# EasyEDA Pro project ProDoc_HMI_2026-03-18.epro

# Board Edge2
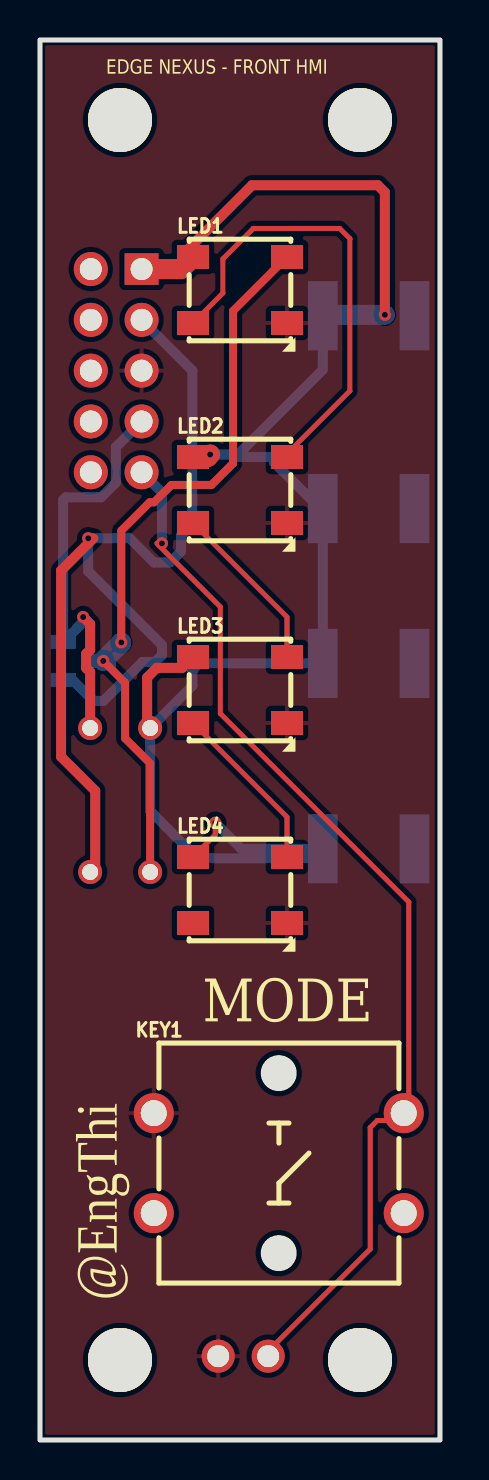
[diagram p0: board, top side]
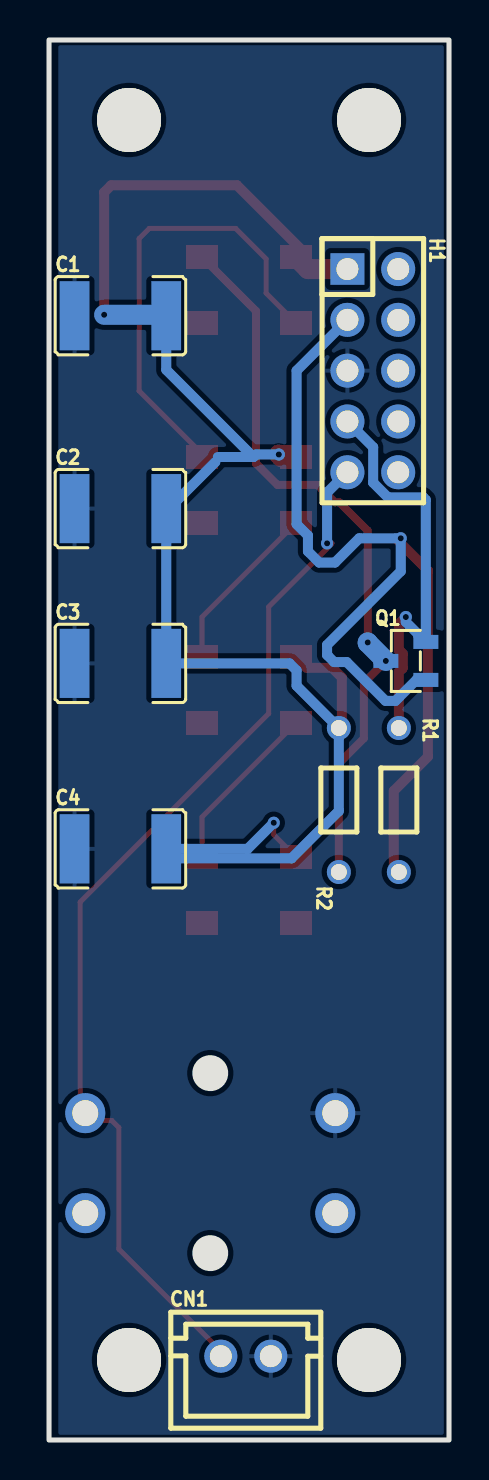
[diagram p1: board, bottom side, seen from below]

Outline 20 x 70 mm; copper layers: Top Layer, Bottom Layer. Coordinates in mm from the lower left corner of the outline.
Outline path: rectangle 0,0 20,70
Stack: Top Layer 0.035mm / Dielectric1 1.51mm FR4 er 4.5 / Bottom Layer 0.035mm

## Design rules (mm)
template: Custom Config
spacing copperThickness1oz (default): track to track 0.102, other pairs 0.152 to 0.3
spacing copperThickness2oz: track to track 0.203, other pairs 0.152 to 0.3
track width copperThickness1oz (default): min 0.127, default 0.254, max 2.54
track width copperThickness2oz: min 0.203, default 0.254, max 2.54
differential pair differentialPair (default): width min 0.127, default 0.254, max 2.54; gap min 0.152, default 0.152
via viaSize (default): diameter min 0.5, default 0.61, max 10; hole min 0.3, default 0.305, max 6.3

## Placement (name value [footprint] x y rotation side)
C1  100nF  [C1812]  16.43 56.21 180 bottom
C2  100nF  [C1812]  16.43 46.57 180 bottom
C3  100nF  [C1812]  16.43 38.83 180 bottom
C4  100nF  [C1812]  16.43 29.56 180 bottom
CN1  2.54mm-2P ZZ  [CONN-TH_2.54MM-2P-ZZ]  10.16 4.19 180 bottom
H1  排母2.54mm2*5p 直  [HDR-TH_10P-P2.54-V-F-R2-C5-S2.54]  3.81 53.47 270 bottom
KEY1  B3F-4055  [KEY-TH_4P-L12.0-W12.0-P5.00-LS13.4-EH]  11.94 13.84 0 top
LED1  WS2812B-V5  [LED-SMD_4P-L5.0-W5.0-LS5.4-TL-1]  10 57.5 0 top
LED2  WS2812B-V5  [LED-SMD_4P-L5.0-W5.0-LS5.4-TL-1]  10 47.5 0 top
LED3  WS2812B-V5  [LED-SMD_4P-L5.0-W5.0-LS5.4-TL-1]  10 37.5 0 top
LED4  WS2812B-V5  [LED-SMD_4P-L5.0-W5.0-LS5.4-TL-1]  10 27.5 0 top
NOREF  -  [Pad_e22]  16 4 0 top
NOREF#2  -  [Pad_e20]  16 66 0 top
NOREF#3  -  [Pad_e21]  4 4 0 top
NOREF#4  -  [Pad_e19]  4 66 0 top
Q1  2N7002  [SOT-23-3_L2.9-W1.3-P1.90-LS2.4-BR]  2.16 38.95 180 bottom
R1  10kΩ  [RES-TH_BD1.8-L3.2-P7.20-D0.4]  2.51 32 270 bottom
R2  10kΩ  [RES-TH_BD1.8-L3.2-P7.20-D0.4]  5.51 32 90 bottom

## Footprints (pads in the part's own frame, mm; a bottom-side part is the same pattern mirrored in y, then rotated)
C1812
  rect 1.485x3.456 smd: 1(-2.292,0) 2(2.292,0)
CONN-TH_2.54MM-2P-ZZ
  round 1.65 hole 1.1: 1(-1.25,0) 2(1.25,0)
HDR-TH_10P-P2.54-V-F-R2-C5-S2.54
  rect 1.575x1.7 hole 1.1: 1(-5.08,-1.27)
  round 1.7 hole 1.1: 2(-5.08,1.27) 3(-2.54,-1.27) 4(-2.54,1.27) 5(0,-1.27) 6(0,1.27) 7(2.54,-1.27) 8(2.54,1.27) 9(5.08,-1.27) 10(5.08,1.27)
KEY-TH_4P-L12.0-W12.0-P5.00-LS13.4-EH
  round 2 hole 1.3: 1(6.25,-2.5) 2(-6.25,-2.5) 3(6.25,2.5) 4(-6.25,2.5)
LED-SMD_4P-L5.0-W5.0-LS5.4-TL-1
  rect 1.6x1.2 smd: 1(-2.35,1.65) 2(-2.35,-1.65) 3(2.35,-1.65) 4(2.35,1.65)
Pad_e19
  round 3.2 hole 3.2: 1(0,0)
Pad_e20
  round 3.2 hole 3.2: 1(0,0)
Pad_e21
  round 3.2 hole 3.2: 1(0,0)
Pad_e22
  round 3.2 hole 3.2: 1(0,0)
RES-TH_BD1.8-L3.2-P7.20-D0.4
  round 1.2 hole 0.8: 1(-3.6,0) 2(3.6,0)
SOT-23-3_L2.9-W1.3-P1.90-LS2.4-BR
  rect 1.25x0.7 smd: 1(1,-0.95) 2(1,0.95) 3(-1,0)

## Nets
3V3_IN: H1.3 Q1.1 R1.2
5V_IN: C1.2 C2.2 C3.2 C4.2 H1.1 LED1.1 LED2.1 LED3.1 LED4.1 R2.2
GND: C1.1 C2.1 C3.1 C4.1 CN1.2 H1.5 KEY1.4 LED1.3 LED2.3 LED3.3 LED4.3
BTN_OUT: CN1.1 H1.9 KEY1.3
JETSON_DATA: H1.7 Q1.2 R1.1
LED_DATA_5V: LED1.4 Q1.3 R2.1
$1N710: LED1.2 LED2.4
$1N717: LED2.2 LED3.4
$1N728: LED3.2 LED4.4

Pads without a net: H1 2 4 6 8 10; KEY1 1 2; LED4 2; NOREF 1; NOREF#2 1; NOREF#3 1; NOREF#4 1

## Via types
v1: diameter 0.61, hole 0.305, Top Layer to Bottom Layer, 8 vias

## Routing (per net, layer and track width the routed paths; a pad name or vN(x,y) marks a point on that pad's centre or on a via; arc(x,y) is an arc through that point)
3V3_IN: length 50
  Top Layer w0.5: 2.67,45.08 1.05,43.47 1.05,34.16 2.76,32.45 2.76,28.4
  Bottom Layer w0.5: Q1.1 1.63,38 2.68,36.96 3.18,36.96 5.12,38.9 5.74,38.9 6.1,39.25 6.1,39.75 2.41,43.43 v1(2.41,45.08) 4.49,45.08 5.7,43.87 6.49,43.87 7.05,44.43 7.05,45.22 7.62,45.79 7.62,53.47 H1.3
5V_IN: length 85.4
  Top Layer w0.254: LED4.1 8.76,30.26 v1(8.76,30.86)
  Top Layer w0.5: v1(17.24,56.26) 17.24,62.38 16.89,62.74 10.6,62.74 7.27,59.4 ; R2.2 5.36,35.75 5.36,38.12 5.84,38.61 7.11,38.61 LED3.1
  Top Layer w1: v1(8.51,49.28) 8.38,49.15 LED2.1 ; H1.1 7.05,58.55 LED1.1
  Bottom Layer w0.5: 9.78,49.15 9.65,49.28 v1(8.51,49.28) ; 9.78,49.15 11.56,49.15 ; 9.78,49.15 14.14,53.51 C1.2 ; 11.68,48.89 14.01,46.57 C2.2 C3.2 7.97,38.83 7.62,38.48 7.62,37.71 R2.2 5.51,31.45 7.87,29.08 13.66,29.08 C4.2 10.07,29.56 v1(8.76,30.86)
  Bottom Layer w1: v1(17.24,56.26) 14.19,56.26 C1.2
BTN_OUT: length 53.6
  Top Layer w0.25: 11.16,4.19 16.51,9.54 16.51,15.62 16.86,15.97 18.07,15.97 18.44,16.34 18.44,26.9 9.02,36.32 9.02,41.66 5.84,44.83
  Bottom Layer w0.5: H1.9 6.1,47.37 v1(6.1,44.83)
JETSON_DATA: length 21.2
  Top Layer w0.5: v1(2.16,41.15) 2.51,40.8 2.51,39.51 2.31,39.31 2.31,38.6 2.51,38.4 R1.1
  Bottom Layer w0.5: 5.08,50.93 3.79,49.64 3.79,47.87 3.06,47.14 1.29,47.14 1.16,47.01 Q1.2 2.16,40.9 v1(2.16,41.15)
LED_DATA_5V: length 36.8
  Top Layer w0.4: v1(3.16,38.95) 4.26,37.86 4.26,35.08 5.51,33.83 R2.1 ; v1(4.06,39.88) 4.06,45.47 5.48,46.89 5.7,46.89 6.57,47.75 8.57,47.75 9.65,48.83 9.65,56.45 LED1.4
  Bottom Layer w1: v1(4.06,39.88) 4.06,39.86 v1(3.16,38.95)
$1N710: length 23.2
  Top Layer w0.25: LED1.2 9.14,57.34 9.14,59.06 10.67,60.58 14.99,60.58 15.49,60.07 15.49,52.45 12.35,49.31 LED2.4
$1N717: length 8.6
  Top Layer w0.25: LED3.4 12.35,41.15 LED2.2
$1N728: length 8.6
  Top Layer w0.25: LED4.4 12.35,31.15 LED3.2

## Copper pours and planes (outline as drawn; the poured copper is in the pictures)
GND on Top Layer: 0,70 19.77,70 19.77,0 0,0
GND on Bottom Layer: 0,70 19.53,70 19.53,0 0,0

## Text on the board
Top Silkscreen Layer: EDGE NEXUS - FRONT HMI | @EngThi | MODE
